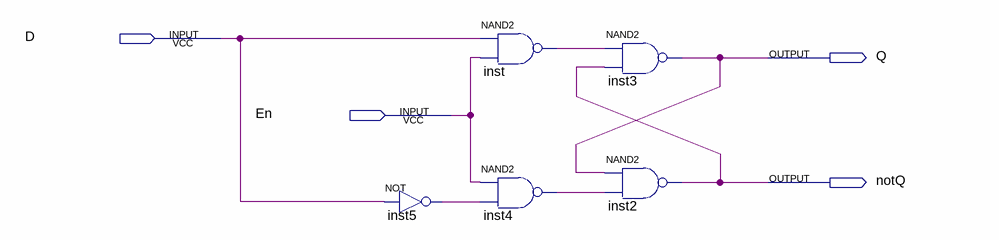
[diagram p0: schematic sheet]
// Quartus schematic D_LATCH.bdf as structural Verilog: 5 symbols, 4 pins
module D_LATCH (
  input  D,
  input  En,
  output Q,
  output notQ
);

  wire inst4_out, inst5_out, inst_out;

  not inst5 (inst5_out, D);
  nand inst (inst_out, D, En);
  nand inst4 (inst4_out, En, inst5_out);
  nand inst3 (Q, inst_out, notQ);
  nand inst2 (notQ, Q, inst4_out);
endmodule
